# Altium project ArmRobot.PrjPcb
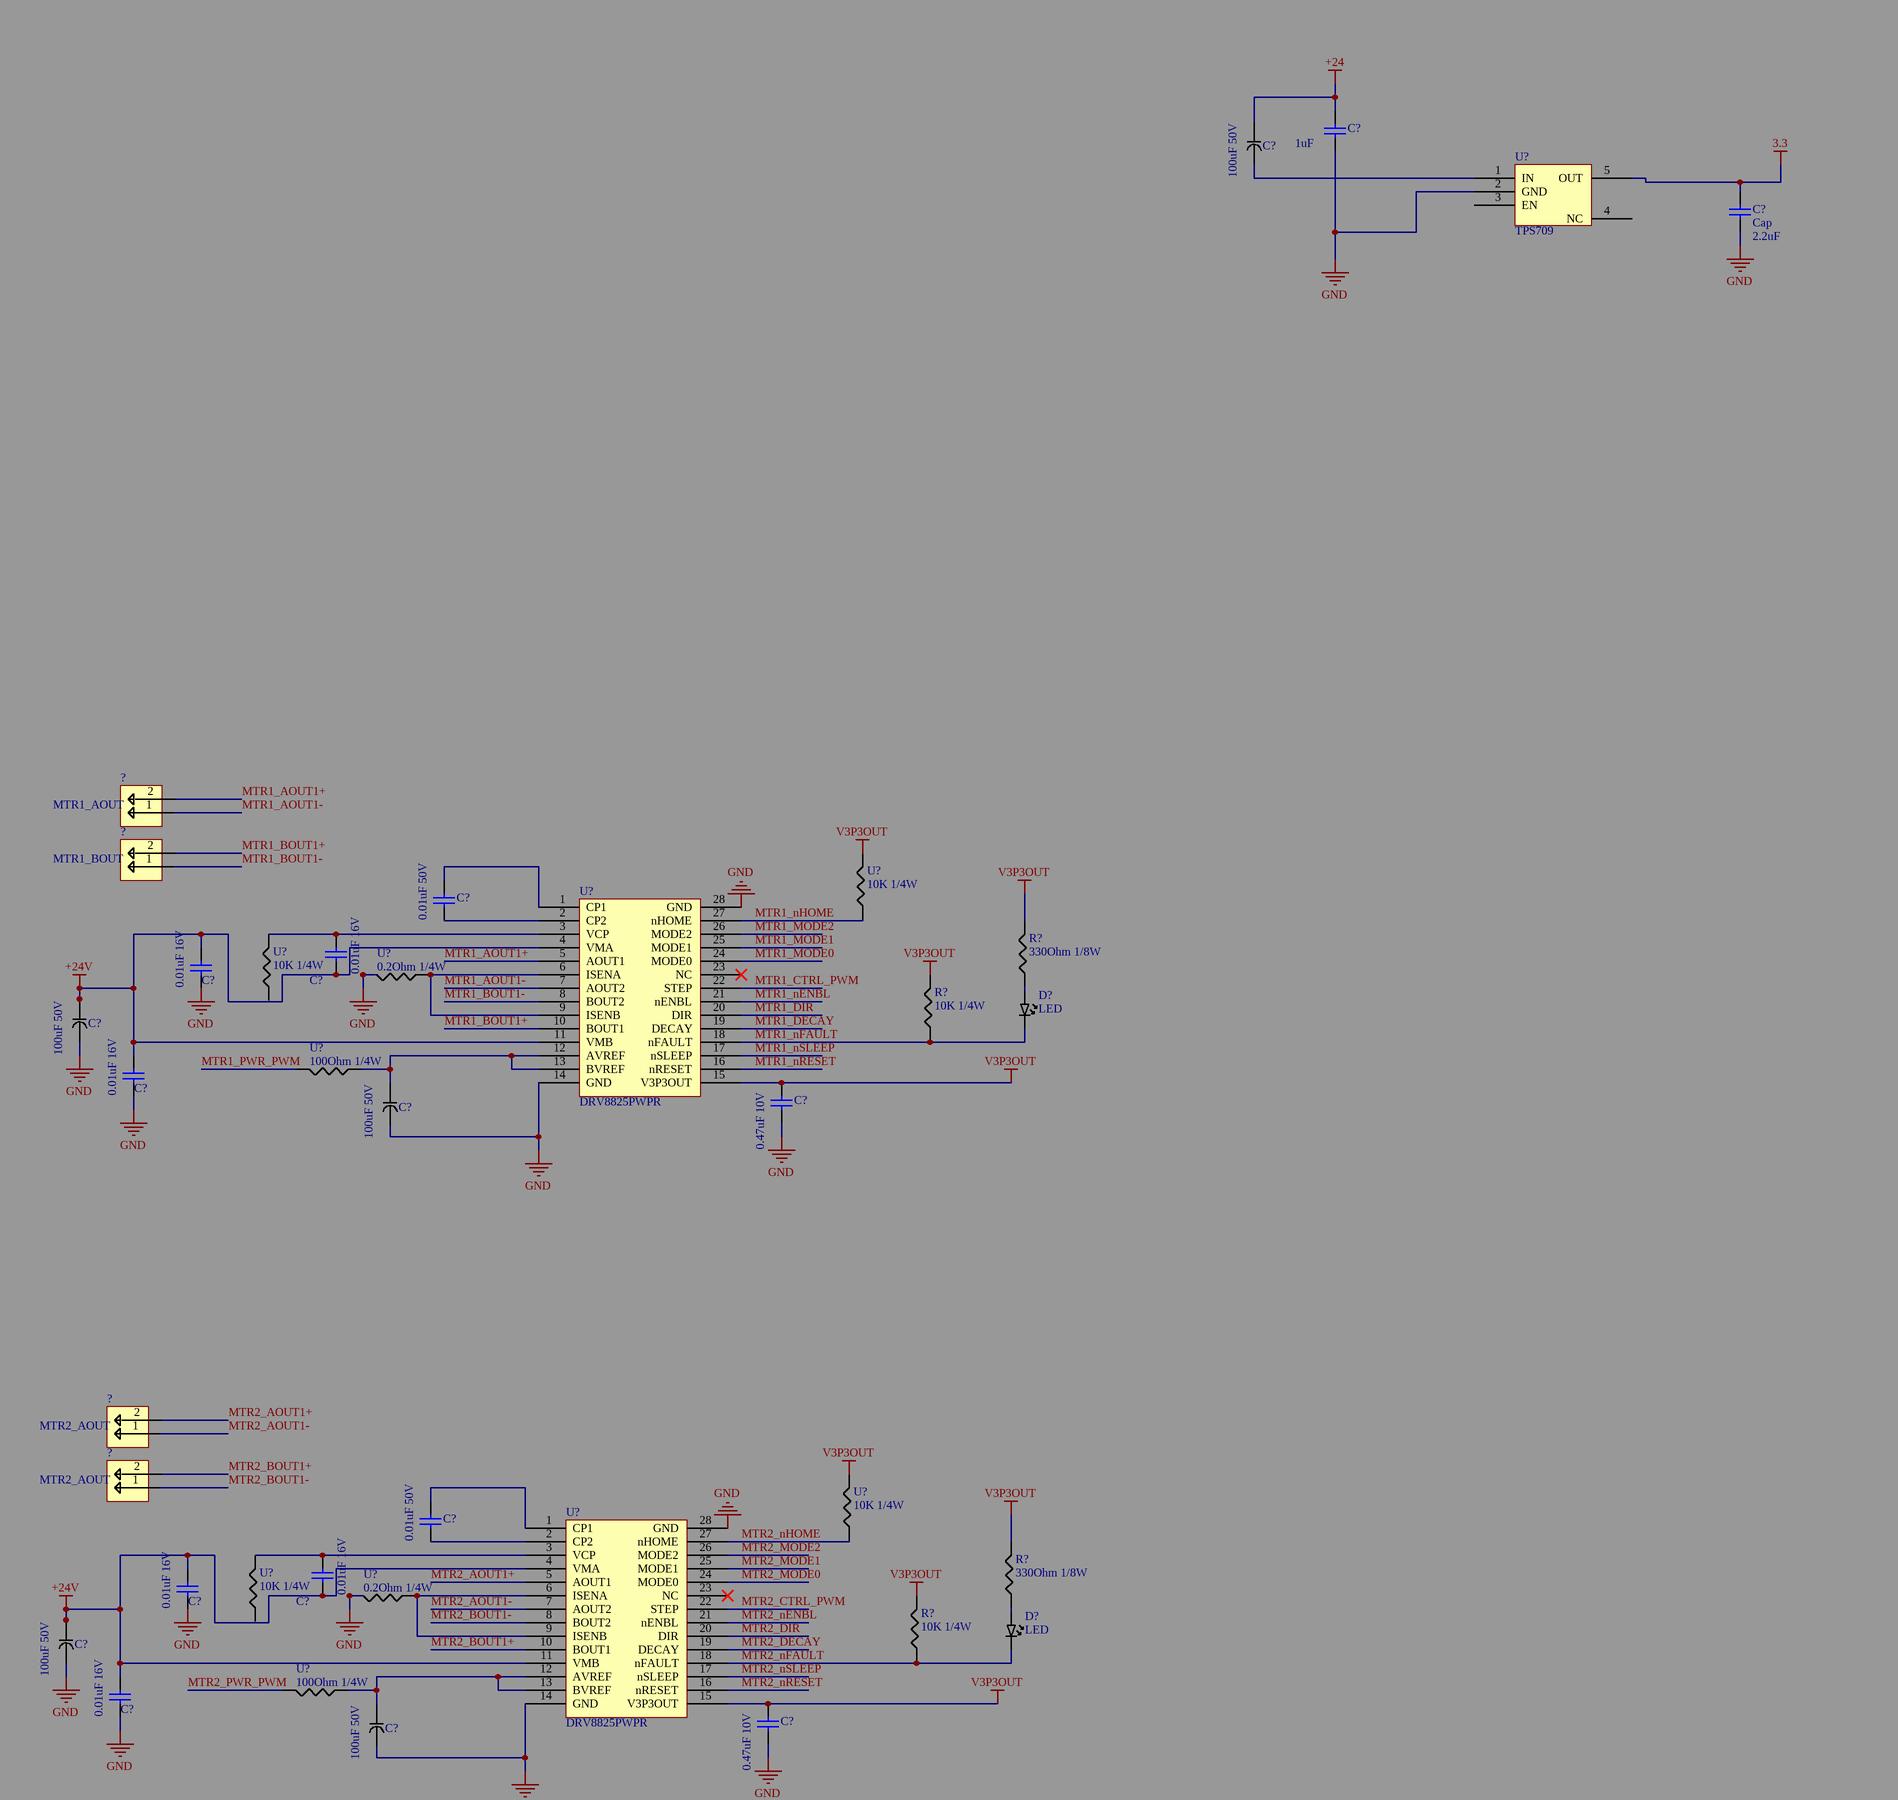
[diagram p0: ArmRobot.SchDoc, top left]
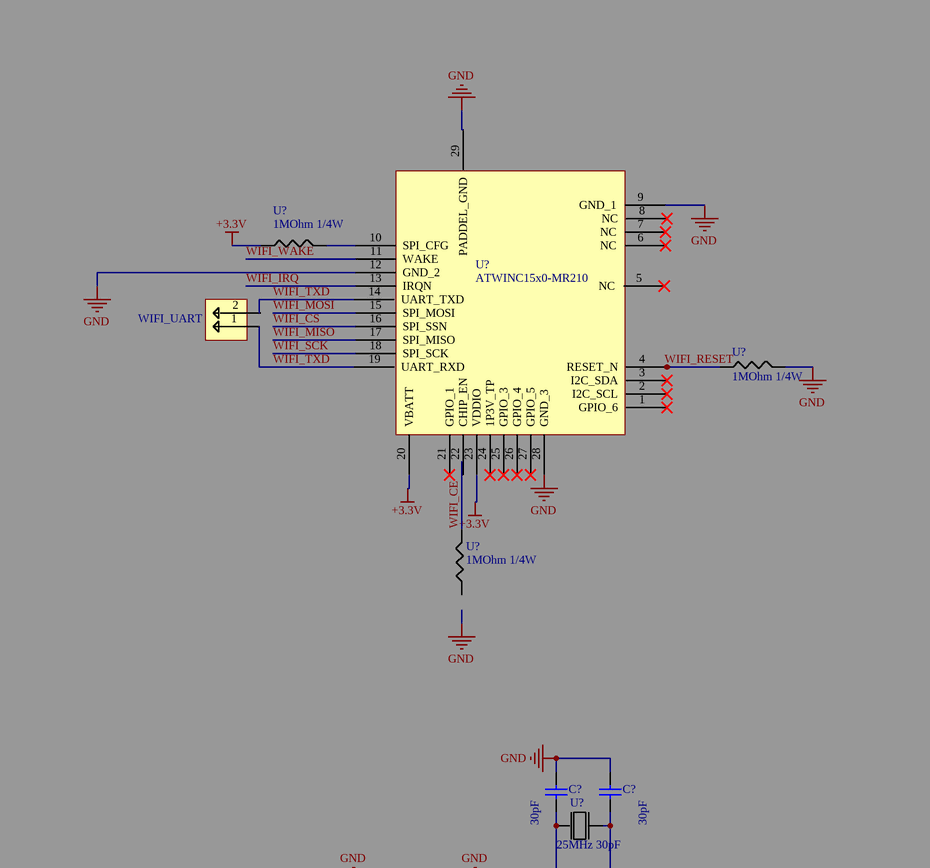
[diagram p1: ArmRobot.SchDoc, top right]
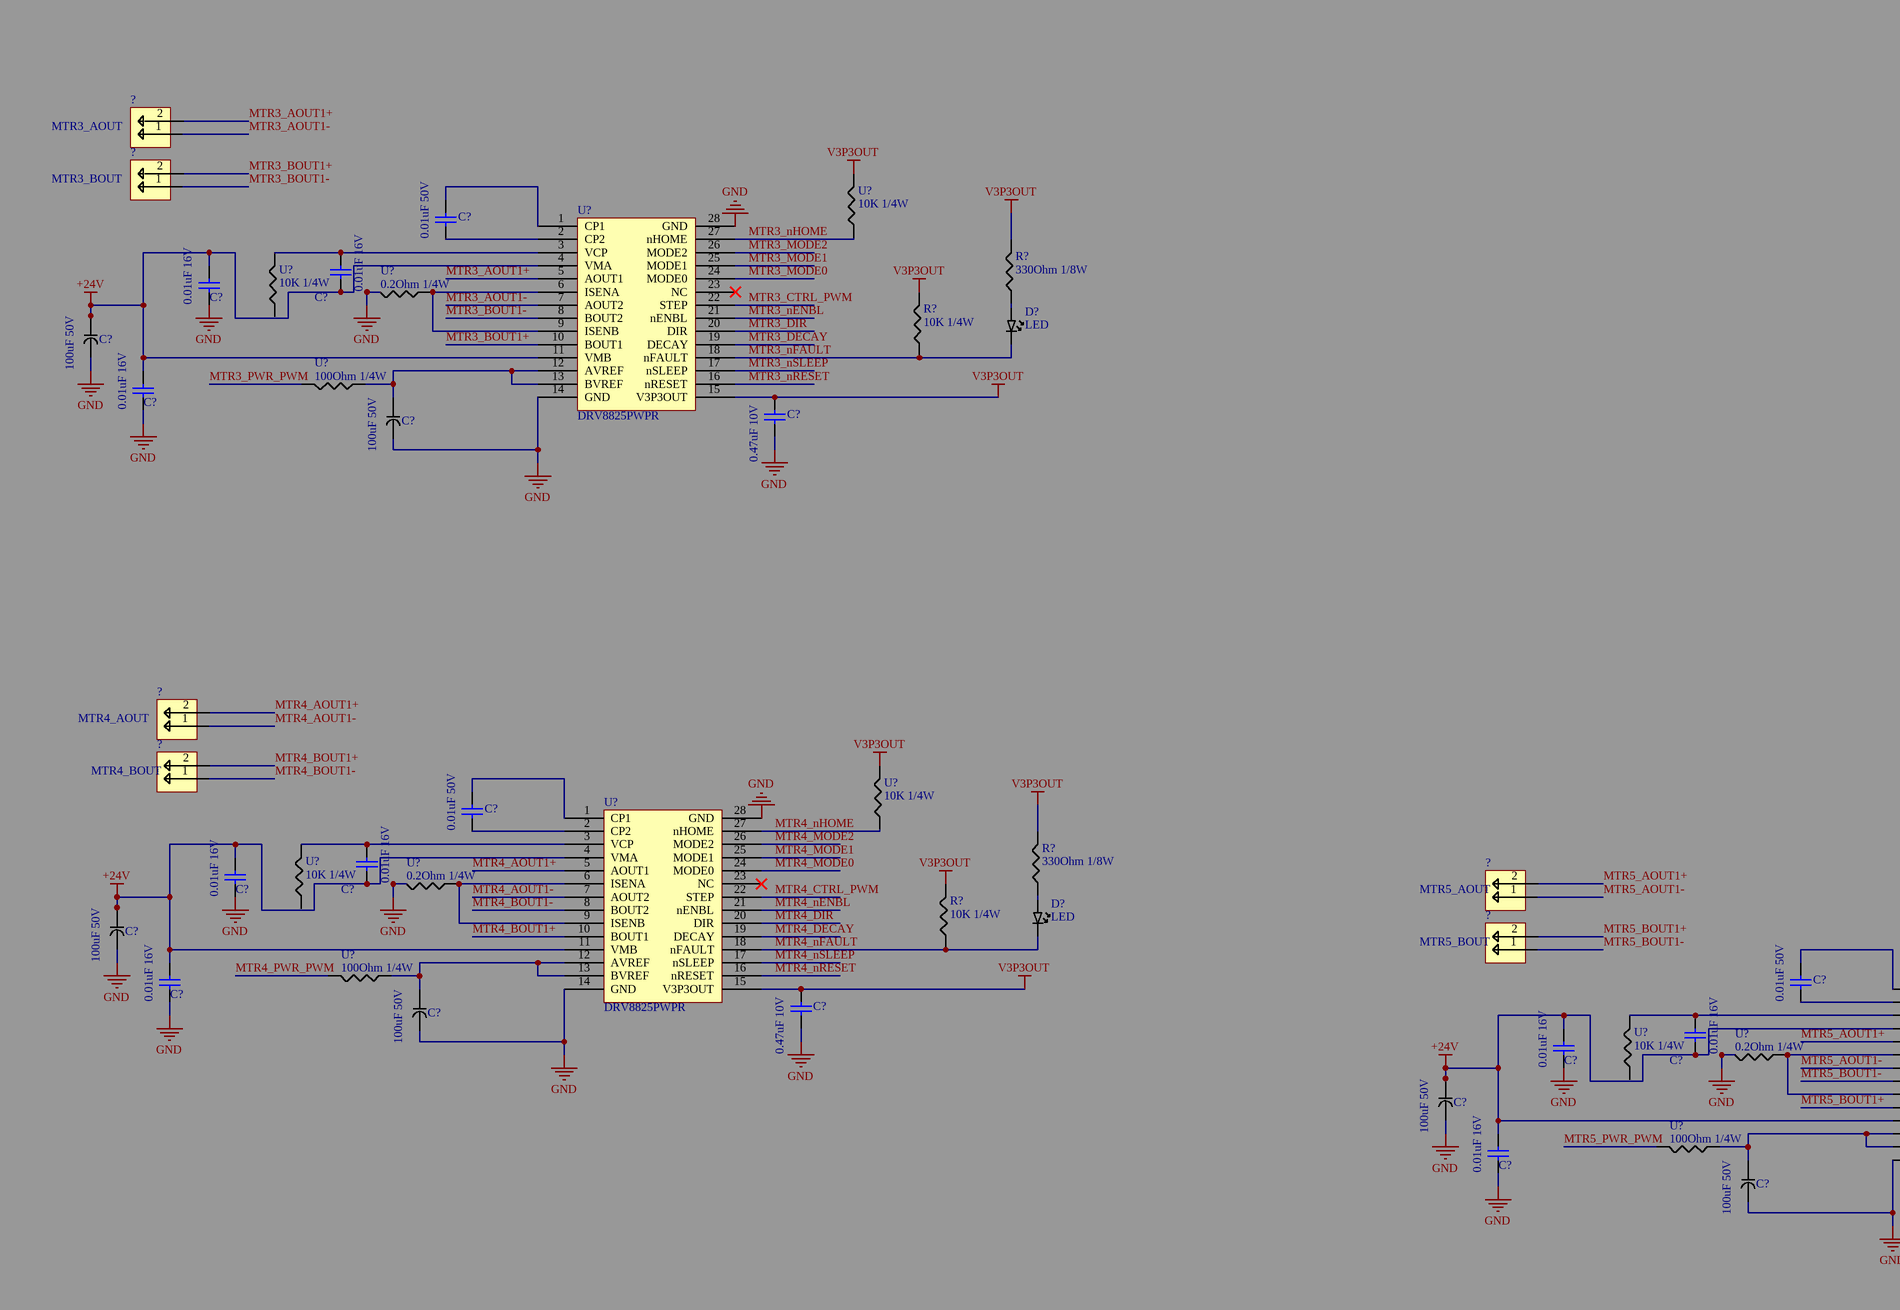
[diagram p2: ArmRobot.SchDoc, bottom left]
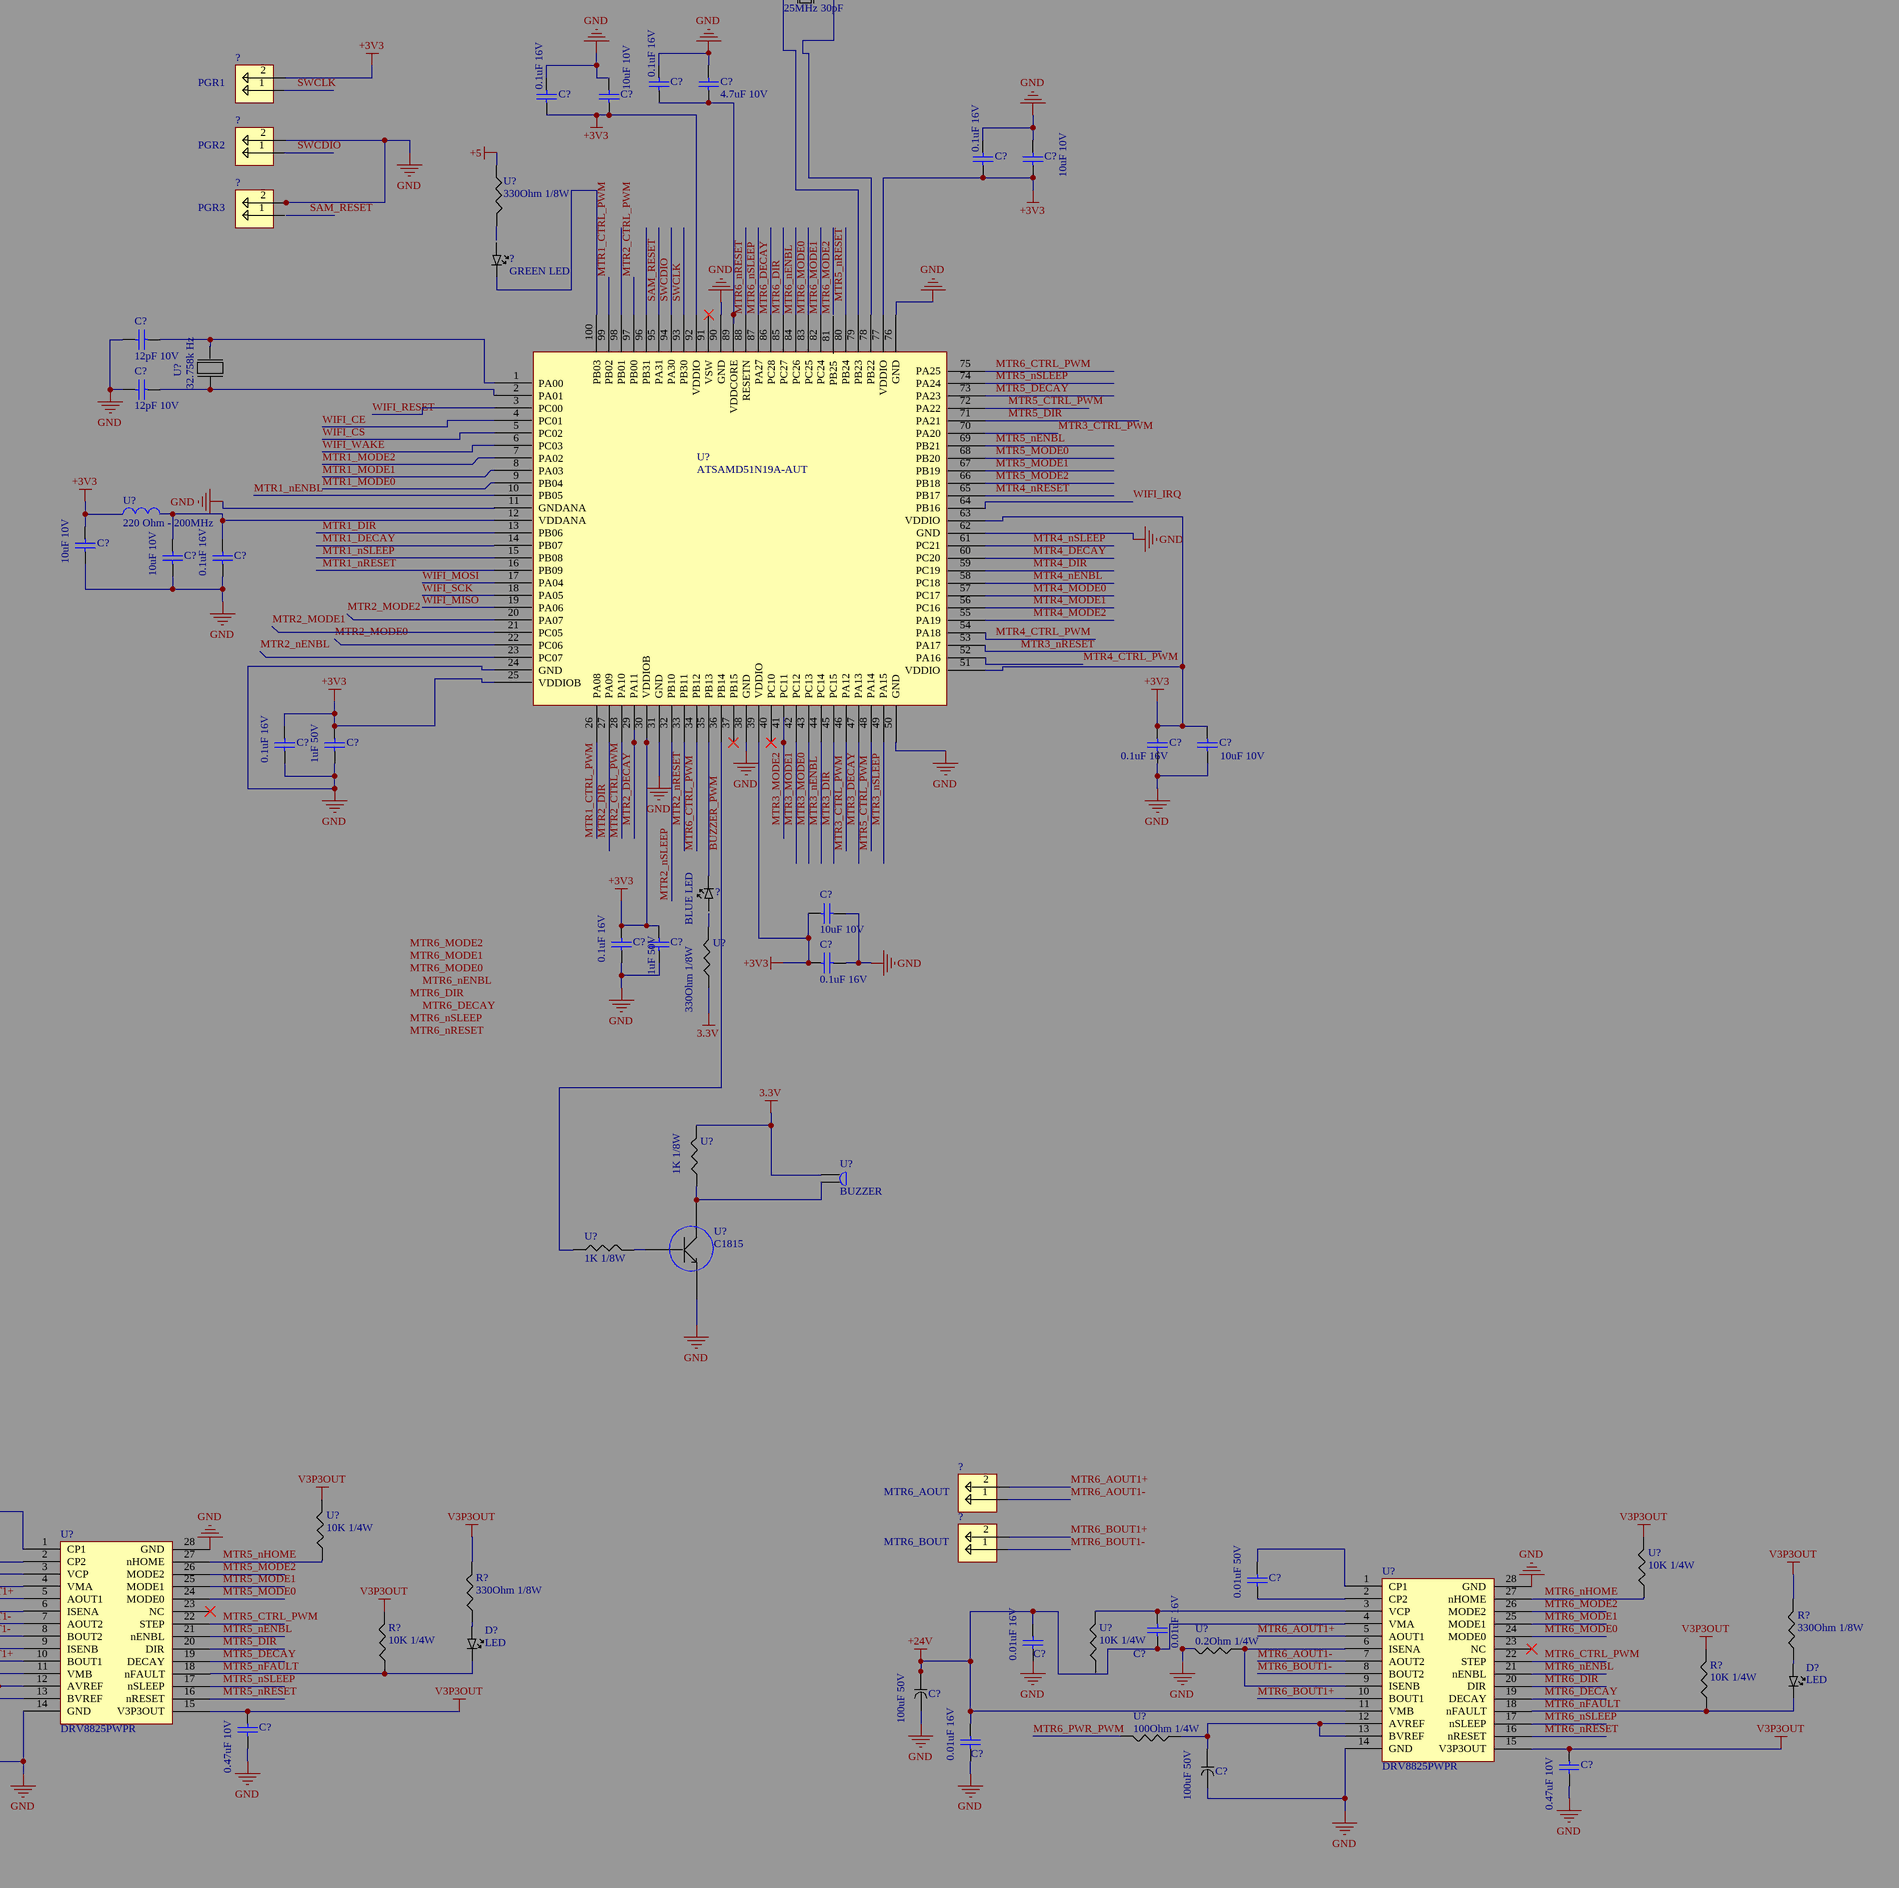
[diagram p3: ArmRobot.SchDoc, bottom right]
1 sheet, 147 parts. Net scope: global (net labels, ports and power ports of the same name join across sheets).

## Sheet ArmRobot.SchDoc
size A0; SheetNumber: 1; SheetTotal: 1

### Parts
(Parts that share a designator on the sheet are numbered #1, #2 ... from top to bottom, then left to right.)
?#1  WIFI_UART
?#2  MTR1_AOUT
?#3  MTR1_BOUT
?#4  PGR1
?#5  PGR2
?#6  MTR2_AOUT
?#7  PGR3
?#8  MTR2_AOUT
?#9  MTR3_AOUT
?#10  MTR3_BOUT
?#11  GREEN LED
?#12  MTR4_AOUT
?#13  MTR4_BOUT
?#14  MTR5_AOUT
?#15  MTR6_AOUT
?#16  MTR5_BOUT
?#17  BLUE LED
?#18  MTR6_BOUT
C?#1  value 1uF  [RAD-0.3]
C?#2  Cap  value 2.2uF  [RAD-0.3]
C?#3  100uF 50V
C?#4  value 0.01uF 50V  [RAD-0.3]
C?#5  value 0.01uF 16V  [RAD-0.3]
C?#6  value 0.01uF 16V  [RAD-0.3]
C?#7  value 0.01uF 16V  [RAD-0.3]
C?#8  value 0.47uF 10V  [RAD-0.3]
C?#9  value 30pF  [RAD-0.3]
C?#10  value 30pF  [RAD-0.3]
C?#11  value 0.1uF 16V  [RAD-0.3]
C?#12  value 4.7uF 10V  [RAD-0.3]
C?#13  value 0.1uF 16V  [RAD-0.3]
C?#14  value 10uF 10V  [RAD-0.3]
C?#15  value 0.1uF 16V  [RAD-0.3]
C?#16  value 10uF 10V  [RAD-0.3]
C?#17  value 0.01uF 50V  [RAD-0.3]
C?#18  value 0.01uF 16V  [RAD-0.3]
C?#19  value 0.01uF 16V  [RAD-0.3]
C?#20  value 12pF 10V  [RAD-0.3]
C?#21  value 12pF 10V  [RAD-0.3]
C?#22  value 0.01uF 16V  [RAD-0.3]
C?#23  100uF 50V
C?#24  value 0.47uF 10V  [RAD-0.3]
C?#25  100uF 50V
C?#26  value 10uF 10V  [RAD-0.3]
C?#27  value 10uF 10V  [RAD-0.3]
C?#28  value 0.1uF 16V  [RAD-0.3]
C?#29  value 0.1uF 16V  [RAD-0.3]
C?#30  value 1uF 50V  [RAD-0.3]
C?#31  value 0.1uF 16V  [RAD-0.3]
C?#32  value 10uF 10V  [RAD-0.3]
C?#33  value 0.01uF 50V  [RAD-0.3]
C?#34  value 0.01uF 16V  [RAD-0.3]
C?#35  value 0.01uF 16V  [RAD-0.3]
C?#36  value 10uF 10V  [RAD-0.3]
C?#37  value 0.1uF 16V  [RAD-0.3]
C?#38  value 1uF 50V  [RAD-0.3]
C?#39  value 0.1uF 16V  [RAD-0.3]
C?#40  value 0.01uF 16V  [RAD-0.3]
C?#41  value 0.47uF 10V  [RAD-0.3]
C?#42  100uF 50V
C?#43  100uF 50V
C?#44  value 0.01uF 50V  [RAD-0.3]
C?#45  value 0.01uF 16V  [RAD-0.3]
C?#46  value 0.01uF 16V  [RAD-0.3]
C?#47  value 0.01uF 16V  [RAD-0.3]
C?#48  value 0.01uF 50V  [RAD-0.3]
C?#49  100uF 50V
C?#50  value 0.47uF 10V  [RAD-0.3]
C?#51  value 0.01uF 50V  [RAD-0.3]
C?#52  value 0.01uF 16V  [RAD-0.3]
C?#53  value 0.01uF 16V  [RAD-0.3]
C?#54  value 0.01uF 16V  [RAD-0.3]
C?#55  100uF 50V
C?#56  value 0.01uF 16V  [RAD-0.3]
C?#57  value 0.01uF 16V  [RAD-0.3]
C?#58  value 0.47uF 10V  [RAD-0.3]
C?#59  value 0.01uF 16V  [RAD-0.3]
C?#60  value 0.47uF 10V  [RAD-0.3]
C?#61  100uF 50V
C?#62  100uF 50V
C?#63  100uF 50V
C?#64  100uF 50V
C?#65  100uF 50V
C?#66  100uF 50V
D?#1  LED
D?#2  LED
D?#3  LED
D?#4  LED
D?#5  LED
D?#6  LED
R?#1  330Ohm 1/8W
R?#2  10K 1/4W
R?#3  330Ohm 1/8W
R?#4  10K 1/4W
R?#5  330Ohm 1/8W
R?#6  10K 1/4W
R?#7  330Ohm 1/8W
R?#8  10K 1/4W
R?#9  330Ohm 1/8W
R?#10  330Ohm 1/8W
R?#11  10K 1/4W
R?#12  10K 1/4W
U?#1  0.2Ohm 1/4W
U?#2  100Ohm 1/4W
U?#3  ATWINC15x0-MR210
U?#4  TPS709
U?#5  10K 1/4W
U?#6  0.2Ohm 1/4W
U?#7  1MOhm 1/4W
U?#8  10K 1/4W
U?#9  100Ohm 1/4W
U?#10  25MHz 30pF
U?#11  1MOhm 1/4W
U?#12  ATSAMD51N19A-AUT
U?#13  330Ohm 1/8W
U?#14  1MOhm 1/4W
U?#15  0.2Ohm 1/4W
U?#16  10K 1/4W
U?#17  DRV8825PWPR
U?#18  100Ohm 1/4W
U?#19  10K 1/4W
U?#20  10K 1/4W
U?#21  0.2Ohm 1/4W
U?#22  DRV8825PWPR
U?#23  10K 1/4W
U?#24  100Ohm 1/4W
U?#25  330Ohm 1/8W
U?#26  0.2Ohm 1/4W
U?#27  32.758k Hz
U?#28  0.2Ohm 1/4W
U?#29  100Ohm 1/4W
U?#30  100Ohm 1/4W
U?#31  220 Ohm - 200MHz
U?#32  1K 1/8W
U?#33  10K 1/4W
U?#34  DRV8825PWPR
U?#35  10K 1/4W
U?#36  10K 1/4W
U?#37  10K 1/4W
U?#38  10K 1/4W
U?#39  10K 1/4W
U?#40  BUZZER
U?#41  C1815
U?#42  1K 1/8W
U?#43  DRV8825PWPR
U?#44  DRV8825PWPR
U?#45  DRV8825PWPR

### Nets
3.3: C?#2.2 U?#4.5(OUT)
3.3V: U?#25.?1 U?#32.?2 U?#40.?1
+3.3V: U?#3.20(VBATT) U?#3.23(VDDIO) U?#11.?1
+3V3: ?#4.2 C?#13.2 C?#14.2 C?#15.2 C?#16.2 C?#26.2 C?#29.2 C?#30.2 C?#31.2 C?#32.2 C?#36.2 C?#37.2 C?#38.2 C?#39.2 U?#12.25(VDDIOB) U?#12.30(VDDIOB) U?#12.39(VDDIO) U?#12.51(VDDIO) U?#12.63(VDDIO) U?#12.77(VDDIO) U?#12.92(VDDIO) U?#31.?1
+5: U?#13.?1
+24: C?#1.2 C?#3.?1
+24V: C?#5.1 C?#6.2 C?#7.2 C?#18.1 C?#19.2 C?#22.2 C?#23.?1 C?#34.1 C?#35.2 C?#40.2 C?#42.?1 C?#45.1 C?#46.2 C?#47.2 C?#49.?1 C?#52.1 C?#53.2 C?#54.1 C?#56.2 C?#57.2 C?#59.2 C?#61.?1 C?#63.?1 C?#64.?1 U?#17.4(VMA) U?#17.11(VMB) U?#22.4(VMA) U?#22.11(VMB) U?#34.4(VMA) U?#34.11(VMB) U?#43.4(VMA) U?#43.11(VMB) U?#44.4(VMA) U?#44.11(VMB) U?#45.4(VMA) U?#45.11(VMB)
GND: ?#5.2 ?#7.2 C?#1.1 C?#2.1 C?#6.1 C?#7.1 C?#8.1 C?#9.2 C?#10.2 C?#11.1 C?#12.1 C?#13.1 C?#14.1 C?#15.1 C?#16.1 C?#19.1 C?#20.2 C?#21.2 C?#22.1 C?#23.?2 C?#24.1 C?#25.?2 C?#26.1 C?#27.1 C?#28.1 C?#29.1 C?#30.1 C?#31.1 C?#32.1 C?#35.1 C?#36.1 C?#37.1 C?#38.1 C?#39.1 C?#40.1 C?#41.1 C?#42.?2 C?#43.?2 C?#46.1 C?#47.1 C?#49.?2 C?#50.1 C?#53.1 C?#55.?2 C?#56.1 C?#57.1 C?#58.1 C?#59.1 C?#60.1 C?#61.?2 C?#62.?2 C?#63.?2 C?#64.?2 C?#65.?2 C?#66.?2 U?#1.?2 U?#3.9(GND_1) U?#3.12(GND_2) U?#3.28(GND_3) U?#3.29(PADDEL_GND) U?#4.2(GND) U?#6.?2 U?#12.11(GNDANA) U?#12.24(GND) U?#12.31(GND) U?#12.38(GND) U?#12.50(GND) U?#12.62(GND) U?#12.76(GND) U?#12.90(GND) U?#14.?2 U?#15.?2 U?#17.14(GND) U?#17.28(GND) U?#21.?2 U?#22.14(GND) U?#22.28(GND) U?#26.?2 U?#28.?2 U?#34.14(GND) U?#34.28(GND) U?#41.?3 U?#43.14(GND) U?#43.28(GND) U?#44.14(GND) U?#44.28(GND) U?#45.14(GND) U?#45.28(GND)
V3P3OUT: C?#8.2 C?#24.2 C?#41.2 C?#50.2 C?#58.2 C?#60.2 R?#1.?2 R?#2.?2 R?#3.?2 R?#4.?2 R?#5.?2 R?#6.?2 R?#7.?2 R?#8.?2 R?#9.?2 R?#10.?2 R?#11.?2 R?#12.?2 U?#5.?2 U?#16.?2 U?#17.15(V3P3OUT) U?#20.?2 U?#22.15(V3P3OUT) U?#33.?2 U?#34.15(V3P3OUT) U?#36.?2 U?#37.?2 U?#43.15(V3P3OUT) U?#44.15(V3P3OUT) U?#45.15(V3P3OUT)
BUZZER_PWM: U?#12.36(PB14) U?#42.?1
MTR1_AOUT1+: ?#2.2 U?#17.5(AOUT1)
MTR1_AOUT1-: ?#2.1 U?#17.7(AOUT2)
MTR1_BOUT1+: ?#3.2 U?#17.10(BOUT1)
MTR1_BOUT1-: ?#3.1 U?#17.8(BOUT2)
MTR1_CTRL_PWM: U?#12.26(PA08) U?#12.99(PB02) U?#17.22(STEP)
MTR1_DECAY: U?#12.14(PB07) U?#17.19(DECAY)
MTR1_DIR: U?#12.13(PB06) U?#17.20(DIR)
MTR1_MODE0: U?#12.9(PB04) U?#17.24(MODE0)
MTR1_MODE1: U?#12.8(PA03) U?#17.25(MODE1)
MTR1_MODE2: U?#12.7(PA02) U?#17.26(MODE2)
MTR1_nENBL: U?#12.10(PB05) U?#17.21(nENBL)
MTR1_nFAULT: D?#1.?2 R?#2.?1 U?#17.18(nFAULT)
MTR1_nHOME: U?#5.?1 U?#17.27(nHOME)
MTR1_nRESET: U?#12.16(PB09) U?#17.16(nRESET)
MTR1_nSLEEP: U?#12.15(PB08) U?#17.17(nSLEEP)
MTR1_PWR_PWM: U?#2.?2
MTR2_AOUT1+: ?#6.2 U?#22.5(AOUT1)
MTR2_AOUT1-: ?#6.1 U?#22.7(AOUT2)
MTR2_BOUT1+: ?#8.2 U?#22.10(BOUT1)
MTR2_BOUT1-: ?#8.1 U?#22.8(BOUT2)
MTR2_CTRL_PWM: U?#12.28(PA10) U?#12.97(PB00) U?#22.22(STEP)
MTR2_DECAY: U?#12.29(PA11) U?#22.19(DECAY)
MTR2_DIR: U?#12.27(PA09) U?#22.20(DIR)
MTR2_MODE0: U?#12.22(PC06) U?#22.24(MODE0)
MTR2_MODE1: U?#12.21(PC05) U?#22.25(MODE1)
MTR2_MODE2: U?#12.20(PA07) U?#22.26(MODE2)
MTR2_nENBL: U?#12.23(PC07) U?#22.21(nENBL)
MTR2_nFAULT: D?#2.?2 R?#4.?1 U?#22.18(nFAULT)
MTR2_nHOME: U?#16.?1 U?#22.27(nHOME)
MTR2_nRESET: U?#12.33(PB11) U?#22.16(nRESET)
MTR2_nSLEEP: U?#12.32(PB10) U?#22.17(nSLEEP)
MTR2_PWR_PWM: U?#9.?2
MTR3_AOUT1+: ?#9.2 U?#34.5(AOUT1)
MTR3_AOUT1-: ?#9.1 U?#34.7(AOUT2)
MTR3_BOUT1+: ?#10.2 U?#34.10(BOUT1)
MTR3_BOUT1-: ?#10.1 U?#34.8(BOUT2)
MTR3_CTRL_PWM: U?#12.46(PA12) U?#12.70(PA20) U?#34.22(STEP)
MTR3_DECAY: U?#12.47(PA13) U?#34.19(DECAY)
MTR3_DIR: U?#12.45(PC15) U?#34.20(DIR)
MTR3_MODE0: U?#12.43(PC13) U?#34.24(MODE0)
MTR3_MODE1: U?#12.42(PC12) U?#34.25(MODE1)
MTR3_MODE2: U?#12.41(PC11) U?#34.26(MODE2)
MTR3_nENBL: U?#12.44(PC14) U?#34.21(nENBL)
MTR3_nFAULT: D?#3.?2 R?#6.?1 U?#34.18(nFAULT)
MTR3_nHOME: U?#20.?1 U?#34.27(nHOME)
MTR3_nRESET: U?#12.53(PA17) U?#34.16(nRESET)
MTR3_nSLEEP: U?#12.49(PA15) U?#34.17(nSLEEP)
MTR3_PWR_PWM: U?#18.?2
MTR4_AOUT1+: ?#12.2 U?#43.5(AOUT1)
MTR4_AOUT1-: ?#12.1 U?#43.7(AOUT2)
MTR4_BOUT1+: ?#13.2 U?#43.10(BOUT1)
MTR4_BOUT1-: ?#13.1 U?#43.8(BOUT2)
MTR4_CTRL_PWM: U?#12.52(PA16) U?#12.54(PA18) U?#43.22(STEP)
MTR4_DECAY: U?#12.60(PC20) U?#43.19(DECAY)
MTR4_DIR: U?#12.59(PC19) U?#43.20(DIR)
MTR4_MODE0: U?#12.57(PC17) U?#43.24(MODE0)
MTR4_MODE1: U?#12.56(PC16) U?#43.25(MODE1)
MTR4_MODE2: U?#12.55(PA19) U?#43.26(MODE2)
MTR4_nENBL: U?#12.58(PC18) U?#43.21(nENBL)
MTR4_nFAULT: D?#4.?2 R?#8.?1 U?#43.18(nFAULT)
MTR4_nHOME: U?#33.?1 U?#43.27(nHOME)
MTR4_nRESET: U?#12.65(PB17) U?#43.16(nRESET)
MTR4_nSLEEP: U?#12.61(PC21) U?#43.17(nSLEEP)
MTR4_PWR_PWM: U?#24.?2
MTR5_AOUT1+: ?#14.2 U?#44.5(AOUT1)
MTR5_AOUT1-: ?#14.1 U?#44.7(AOUT2)
MTR5_BOUT1+: ?#16.2 U?#44.10(BOUT1)
MTR5_BOUT1-: ?#16.1 U?#44.8(BOUT2)
MTR5_CTRL_PWM: U?#12.48(PA14) U?#12.72(PA22) U?#44.22(STEP)
MTR5_DECAY: U?#12.73(PA23) U?#44.19(DECAY)
MTR5_DIR: U?#12.71(PA21) U?#44.20(DIR)
MTR5_MODE0: U?#12.68(PB20) U?#44.24(MODE0)
MTR5_MODE1: U?#12.67(PB19) U?#44.25(MODE1)
MTR5_MODE2: U?#12.66(PB18) U?#44.26(MODE2)
MTR5_nENBL: U?#12.69(PB21) U?#44.21(nENBL)
MTR5_nFAULT: D?#5.?2 R?#11.?1 U?#44.18(nFAULT)
MTR5_nHOME: U?#36.?1 U?#44.27(nHOME)
MTR5_nRESET: U?#12.80(PB24) U?#44.16(nRESET)
MTR5_nSLEEP: U?#12.74(PA24) U?#44.17(nSLEEP)
MTR5_PWR_PWM: U?#29.?2
MTR6_AOUT1+: ?#15.2 U?#45.5(AOUT1)
MTR6_AOUT1-: ?#15.1 U?#45.7(AOUT2)
MTR6_BOUT1+: ?#18.2 U?#45.10(BOUT1)
MTR6_BOUT1-: ?#18.1 U?#45.8(BOUT2)
MTR6_CTRL_PWM: U?#12.34(PB12) U?#12.75(PA25) U?#45.22(STEP)
MTR6_DECAY: U?#12.86(PC28) U?#45.19(DECAY)
MTR6_DIR: U?#12.85(PC27) U?#45.20(DIR)
MTR6_MODE0: U?#12.83(PC25) U?#45.24(MODE0)
MTR6_MODE1: U?#12.82(PC24) U?#45.25(MODE1)
MTR6_MODE2: U?#45.26(MODE2)
MTR6_nENBL: U?#12.84(PC26) U?#45.21(nENBL)
MTR6_nFAULT: D?#6.?2 R?#12.?1 U?#45.18(nFAULT)
MTR6_nHOME: U?#37.?1 U?#45.27(nHOME)
MTR6_nRESET: U?#12.88(RESETN) U?#45.16(nRESET)
MTR6_nSLEEP: U?#12.87(PA27) U?#45.17(nSLEEP)
MTR6_PWR_PWM: U?#30.?2
SAM_RESET: U?#12.95(PA31)
SWCDIO: ?#5.1 U?#12.94(PA30)
SWCLK: ?#4.1 U?#12.93(PB30)
WIFI_CE: U?#7.?2 U?#12.4(PC01)
WIFI_CS: U?#3.16(SPI_SSN) U?#12.5(PC02)
WIFI_IRQ: U?#3.13(IRQN) U?#12.64(PB16)
WIFI_MISO: U?#3.17(SPI_MISO) U?#12.19(PA06)
WIFI_MOSI: U?#3.15(SPI_MOSI) U?#12.17(PA04)
WIFI_RESET: U?#3.4(RESET_N) U?#12.3(PC00) U?#14.?1
WIFI_SCK: U?#3.18(SPI_SCK) U?#12.18(PA05)
WIFI_TXD: ?#1.1 U?#3.14(UART_TXD) U?#3.19(UART_RXD)
WIFI_WAKE: U?#3.11(WAKE) U?#12.6(PC03)
Net?#11_?2: ?#11.?2 U?#12.100(PB03)
Net?#17_?2: ?#17.?2 U?#12.35(PB13)
NetC?#3_?2: C?#3.?2 U?#4.1(IN)
NetC?#4_1: C?#4.1 U?#17.2(CP2)
NetC?#4_2: C?#4.2 U?#17.1(CP1)
NetC?#5_2: C?#5.2 U?#8.?2 U?#17.3(VCP)
NetC?#9_1: C?#9.1 U?#10.?1 U?#12.79(PB23)
NetC?#10_1: C?#10.1 U?#10.?2 U?#12.78(PB22)
NetC?#11_2: C?#11.2 C?#12.2 U?#12.89(VDDCORE)
NetC?#17_1: C?#17.1 U?#22.2(CP2)
NetC?#17_2: C?#17.2 U?#22.1(CP1)
NetC?#18_2: C?#18.2 U?#19.?2 U?#22.3(VCP)
NetC?#20_1: C?#20.1 U?#12.1(PA00) U?#27.?2
NetC?#21_1: C?#21.1 U?#12.2(PA01) U?#27.?1
NetC?#25_?1: C?#25.?1 U?#2.?1 U?#17.12(AVREF) U?#17.13(BVREF)
NetC?#27_2: C?#27.2 C?#28.2 U?#12.12(VDDANA) U?#31.?2
NetC?#33_1: C?#33.1 U?#34.2(CP2)
NetC?#33_2: C?#33.2 U?#34.1(CP1)
NetC?#34_2: C?#34.2 U?#23.?2 U?#34.3(VCP)
NetC?#43_?1: C?#43.?1 U?#9.?1 U?#22.12(AVREF) U?#22.13(BVREF)
NetC?#44_1: C?#44.1 U?#43.2(CP2)
NetC?#44_2: C?#44.2 U?#43.1(CP1)
NetC?#45_2: C?#45.2 U?#35.?2 U?#43.3(VCP)
NetC?#48_1: C?#48.1 U?#44.2(CP2)
NetC?#48_2: C?#48.2 U?#44.1(CP1)
NetC?#51_1: C?#51.1 U?#45.2(CP2)
NetC?#51_2: C?#51.2 U?#45.1(CP1)
NetC?#52_2: C?#52.2 U?#38.?2 U?#44.3(VCP)
NetC?#54_2: C?#54.2 U?#39.?2 U?#45.3(VCP)
NetC?#55_?1: C?#55.?1 U?#18.?1 U?#34.12(AVREF) U?#34.13(BVREF)
NetC?#62_?1: C?#62.?1 U?#24.?1 U?#43.12(AVREF) U?#43.13(BVREF)
NetC?#65_?1: C?#65.?1 U?#29.?1 U?#44.12(AVREF) U?#44.13(BVREF)
NetC?#66_?1: C?#66.?1 U?#30.?1 U?#45.12(AVREF) U?#45.13(BVREF)
NetD?#1_?1: D?#1.?1 R?#1.?1
NetD?#2_?1: D?#2.?1 R?#3.?1
NetD?#3_?1: D?#3.?1 R?#5.?1
NetD?#4_?1: D?#4.?1 R?#7.?1
NetD?#5_?1: D?#5.?1 R?#9.?1
NetD?#6_?1: D?#6.?1 R?#10.?1
NetU?#1_?1: U?#1.?1 U?#17.6(ISENA) U?#17.9(ISENB)
NetU?#3_10: U?#3.10(SPI_CFG) U?#11.?2
NetU?#6_?1: U?#6.?1 U?#22.6(ISENA) U?#22.9(ISENB)
NetU?#15_?1: U?#15.?1 U?#34.6(ISENA) U?#34.9(ISENB)
NetU?#21_?1: U?#21.?1 U?#43.6(ISENA) U?#43.9(ISENB)
NetU?#26_?1: U?#26.?1 U?#44.6(ISENA) U?#44.9(ISENB)
NetU?#28_?1: U?#28.?1 U?#45.6(ISENA) U?#45.9(ISENB)
NetU?#32_?1: U?#32.?1 U?#40.?2 U?#41.?1
NetU?#41_?2: U?#41.?2 U?#42.?2

Not connected (* = marked no-connect by the designer): ?#1 2; ?#7 1; ?#11 ?1; ?#17 ?1; U?#3 1(GPIO_6)* 2(I2C_SCL)* 3(I2C_SDA)* 5(NC)* 6(NC)* 7(NC)* 8(NC)* 21(GPIO_1)* 22(CHIP_EN) 24(1P3V_TP)* 25(GPIO_3)* 26(GPIO_4)* 27(GPIO_5)*; U?#4 3(EN) 4(NC); U?#7 ?1; U?#8 ?1; U?#12 37(PB15)* 40(PC10)* 81(PB25) 91(VSW)* 96(PB31) 98(PB01); U?#13 ?2; U?#17 23(NC)*; U?#19 ?1; U?#22 23(NC)*; U?#23 ?1; U?#25 ?2; U?#34 23(NC)*; U?#35 ?1; U?#38 ?1; U?#39 ?1; U?#43 23(NC)*; U?#44 23(NC)*; U?#45 23(NC)*

### Notes on the sheet
- Labels drawn without touching a wire or pin: MTR6_DECAY, MTR6_DIR, MTR6_MODE0, MTR6_MODE1, MTR6_MODE2, MTR6_nENBL, MTR6_nRESET, MTR6_nSLEEP

### Library data of the parts
?#1-?#10 ?#12-?#16 ?#18 = 51300211121
?#11 ?#17 = LED
C?#1 C?#2 C?#4-C?#22 C?#24 C?#26-C?#41 C?#44-C?#48 C?#50-C?#54 C?#56-C?#60 = Cap: Capacitor; Published: 8-Jun-2000; LatestRevisionDate: 17-Jul-2002; LatestRevisionNote: Re-released for DXP Platform.; PackageReference: RAD-0.3; Publisher: Altium Limited; PackageDescription: Radial Cap, Thru-Hole; 2 Leads; 0.3 in Pin Spacing
C?#3 C?#23 C?#25 C?#42 C?#43 C?#49 C?#55 C?#61-C?#66 = Capacitor
R?#1-R?#12 U?#1 U?#2 U?#5-U?#9 U?#11 U?#13-U?#16 U?#18-U?#21 U?#23-U?#26 U?#28-U?#30 U?#32 U?#33 U?#35-U?#39 U?#42 = Rohm Semiconductor
U?#10 U?#27 = ESC-327-12-5-34B-TR
U?#31 = MPZ1608S22ATA00
U?#41 = Transistor